# EAGLE design pidcontroller-mega32 (EAGLE 6.5.0)
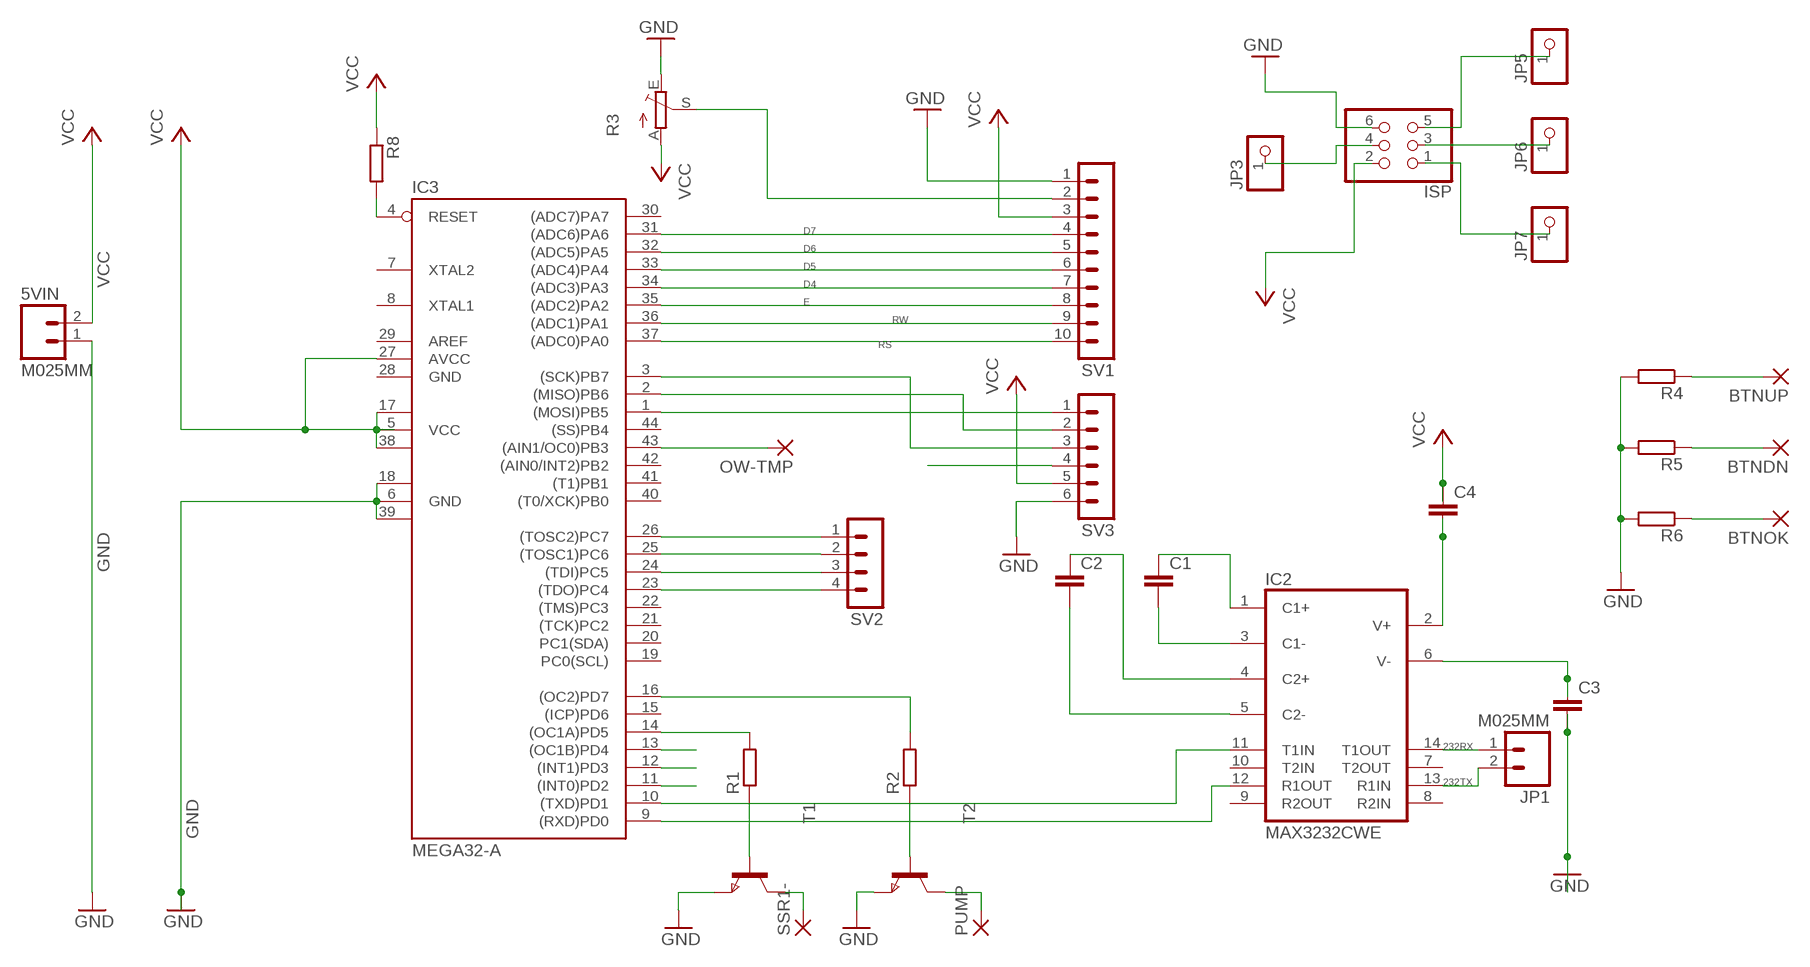
[diagram p0: schematic, sheet 1]

## Parts
5VIN  M025MM  [SCREWTERMINAL-5MM-2]
BTNDN  2,15/1,0  [2,15/1,0]
BTNOK  2,15/1,0  [2,15/1,0]
BTNUP  2,15/1,0  [2,15/1,0]
C1  C-EUC1206  [C1206]
C2  C-EUC1206  [C1206]
C3  C-EUC1206  [C1206]
C4  C-EUC1206  [C1206]
IC2  MAX3232CWE  [SO16L]
IC3  MEGA32-A  [TQFP44]
ISP  PINHD-2X3  [2X03]
JP1  M025MM  [SCREWTERMINAL-5MM-2]
JP3  PINHD-1X1  [1X01]
JP5  PINHD-1X1  [1X01]
JP6  PINHD-1X1  [1X01]
JP7  PINHD-1X1  [1X01]
OW-TMP  2,15/1,0  [2,15/1,0]
PUMP  2,15/1,0  [2,15/1,0]
R1  R-EU_R0603  [R0603]
R2  R-EU_R0603  [R0603]
R3  TRIM_EU-LI10  [LI10]
R4  R-EU_R0603  [R0603]
R5  R-EU_R0603  [R0603]
R6  R-EU_R0603  [R0603]
R8  R-EU_R0603  [R0603]
SSR1-  2,15/1,0  [2,15/1,0]
SV1  MA10-1  [MA10-1]
SV2  MA04-1  [MA04-1]
SV3  MA06-1  [MA06-1]
T1  NPNSOT23  [SOT-23]
T2  NPNSOT23  [SOT-23]

## Nets
232RX: IC2.14(T1OUT) JP1.1
232TX: IC2.13(R1IN) JP1.2
BTNDN: BTNDN.1(P) IC3.12((INT1)PD3) R5.1
BTNOK: BTNOK.1(P) IC3.11((INT0)PD2) R6.1
BTNUP: BTNUP.1(P) IC3.13((OC1B)PD4) R4.1
D4: IC3.34((ADC3)PA3) SV1.7
D5: IC3.33((ADC4)PA4) SV1.6
D6: IC3.32((ADC5)PA5) SV1.5
D7: IC3.31((ADC6)PA6) SV1.4
E: IC3.35((ADC2)PA2) SV1.8
GND: 5VIN.1 C3.2 IC3.6(GND) IC3.18(GND1) IC3.39(GND2) ISP.6 R3.E R4.2 R5.2 R6.2 SV1.1 SV3.6 T1.2(E) T2.2(E)
N$1: IC3.3((SCK)PB7) SV3.3
N$2: R1.1 T1.3(B)
N$3: R2.1 T2.3(B)
N$4: IC3.14((OC1A)PD5) R1.2
N$5: C2.2 IC2.5(C2-)
N$6: C2.1 IC2.4(C2+)
N$7: C1.2 IC2.3(C1-)
N$8: C1.1 IC2.1(C1+)
N$9: C4.2 IC2.2(V+)
N$10: IC3.16((OC2)PD7) R2.2
N$11: C3.1 IC2.6(V-)
N$12: IC2.11(T1IN) IC3.10((TXD)PD1)
N$13: IC2.12(R1OUT) IC3.9((RXD)PD0)
N$14: IC3.1((MOSI)PB5) SV3.1
N$15: IC3.2((MISO)PB6) SV3.2
N$16: IC3.43((AIN1/OC0)PB3) OW-TMP.1(P)
N$17: R3.S SV1.2
N$22: ISP.4 JP3.1
N$23: SSR1-.1(P) T1.1(C)
N$24: PUMP.1(P) T2.1(C)
N$26: ISP.1 JP7.1
N$27: ISP.3 JP6.1
N$28: ISP.5 JP5.1
N$40: IC3.26((TOSC2)PC7) SV2.1
N$41: IC3.25((TOSC1)PC6) SV2.2
N$42: IC3.24((TDI)PC5) SV2.3
N$43: IC3.23((TDO)PC4) SV2.4
RESET: IC3.4(RESET) R8.2 SV3.4
RS: IC3.37((ADC0)PA0) SV1.10
RW: IC3.36((ADC1)PA1) SV1.9
VCC: 5VIN.2 C4.1 IC3.5(VCC) IC3.17(VCC1) IC3.27(AVCC) IC3.38(VCC2) ISP.2 R3.A R8.1 SV1.3 SV3.5
Unconnected: IC2.7(T2OUT) IC2.8(R2IN) IC2.9(R2OUT) IC2.10(T2IN) IC3.7(XTAL2) IC3.8(XTAL1) IC3.15((ICP)PD6) IC3.19(PC0(SCL)) IC3.20(PC1(SDA)) IC3.21((TCK)PC2) IC3.22((TMS)PC3) IC3.29(AREF) IC3.30((ADC7)PA7) IC3.40((T0/XCK)PB0) IC3.41((T1)PB1) IC3.42((AIN0/INT2)PB2) IC3.44((SS)PB4)

## Power pins joined to a net without a drawn wire
GND: IC2.15(GND) IC3.28(GND)
VCC: IC2.16(VCC)

## Library data of the parts
5VIN JP1 = SparkFun-Connectors:M02: Standard 2-pin 0.1" header. Use with - straight break away headers ( PRT-00116) - right angle break away headers (PRT-00553) - swiss pins (PRT-00743) - machine pins (PRT-00117) - female headers (PRT-00115) Molex polarized connector foot print use with: PRT-08233 with associated crimp pins and housings. 2.54_SCREWTERM for use with PRT-10571. 3.5mm Screw Terminal footprints for PRT-08084 5mm Screw Terminal footprints for use with PRT-08433
BTNDN BTNOK BTNUP OW-TMP PUMP SSR1- = wirepad:2,15/1,0: THROUGH-HOLE PAD
C1-C4 = resistor:C-EU: CAPACITOR, European symbol
IC2 = maxim:MAX3232*: True RS-232 Transceivers 3.0V to 5.5V, Low-Power up to 1Mbps, Using Four 0.1µF External Capacitors Source: http://pdfserv.maxim-ic.com/en/ds/MAX3222-MAX3241.pdf; MF: MAXIM; MPN: MAX3232CWE+; OC_FARNELL: 9725504; OC_NEWARK: 68K4630
IC3 = atmel:MEGA32: MICROCONTROLLER 32 Kbytes FLASH 2 Kbytes SRAM 1 Kbytes EEPROM USART 8-channel 10 bit ADC Source: www.atmel.com .. doc2503.pdf; MPN: ATMEGA32-16AU; OC_FARNELL: 9171274; OC_NEWARK: 69K6677
ISP = pinhead:PINHD-2X3: PIN HEADER
JP3 JP5-JP7 = pinhead:PINHD-1X1: PIN HEADER
R1 R2 R4-R6 R8 = resistor:R-EU_: RESISTOR, European symbol
R3 = pot:TRIM_EU-: POTENTIOMETER
SV1 = con-lstb:MA10-1: PIN HEADER; OC_FARNELL: unknown; OC_NEWARK: unknown
SV2 = con-lstb:MA04-1: PIN HEADER; OC_FARNELL: unknown; OC_NEWARK: unknown
SV3 = con-lstb:MA06-1: PIN HEADER; OC_FARNELL: unknown; OC_NEWARK: unknown
T1 T2 = zetex:NPNSOT23: NPN TRANSISTOR; MPN: DSS20201L-7; OC_FARNELL: 1710688; OC_NEWARK: 25R4555

## Net classes
0 default: width 0.381 mm, drill 0.762 mm, clearance 0.381 mm

## Board
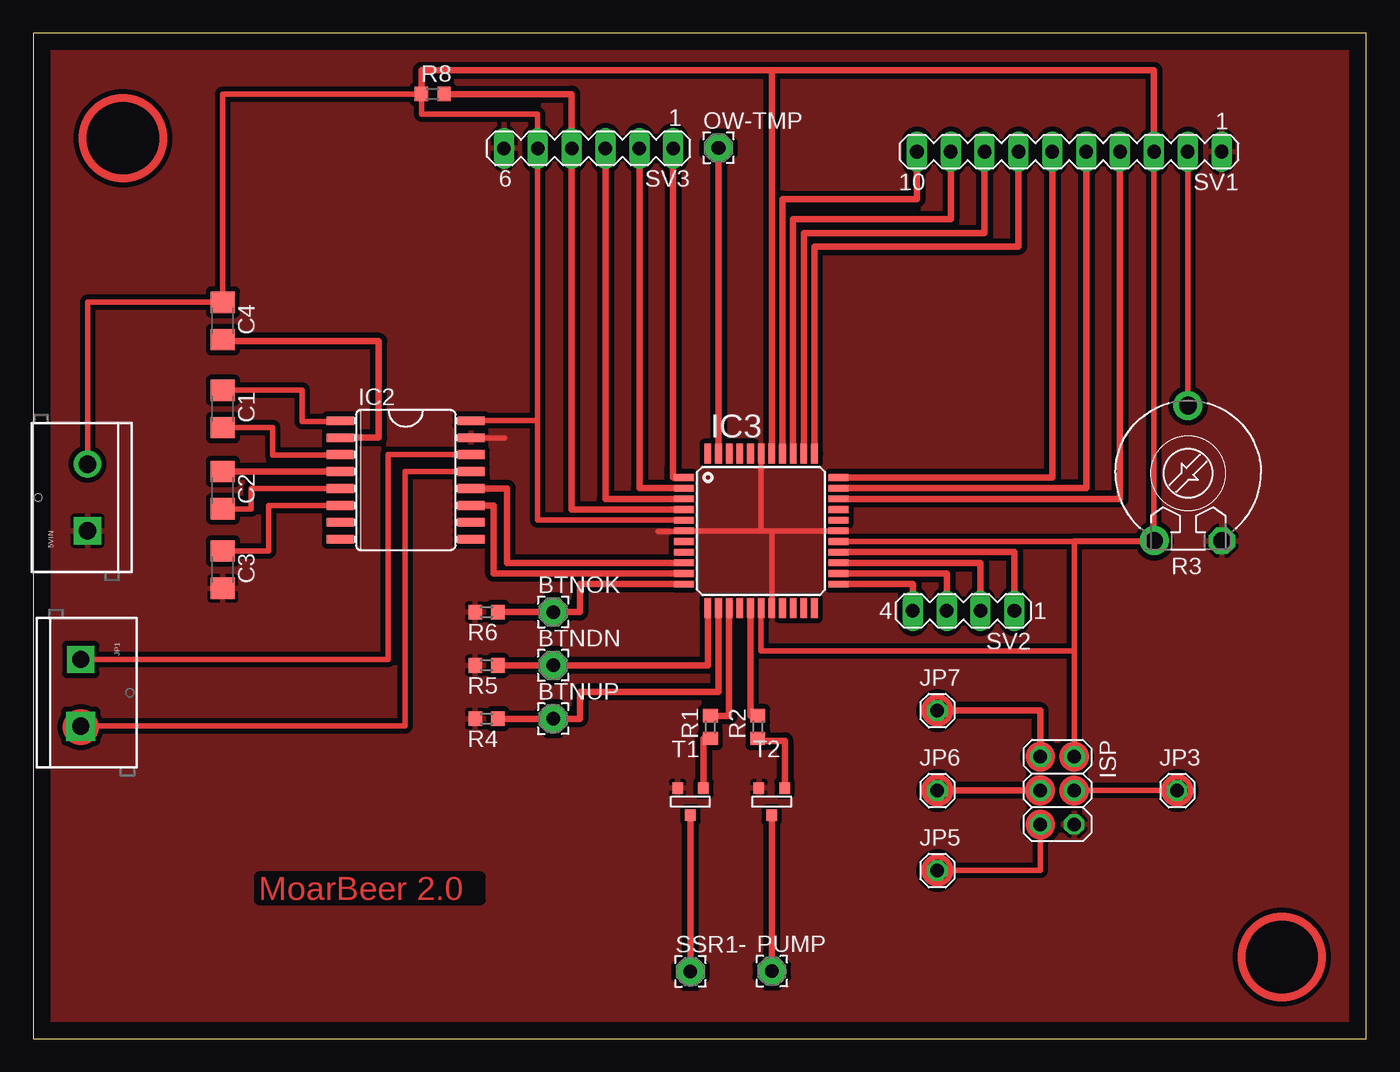
[diagram p1: board, top side]

Size 100 x 75.43 mm. Coordinates in mm from the lower left corner, seen from the top.
Outline: 0,0 100,0 100,75.43 0,75.43 0,0
Copper layers (1*16): Top 0.035mm / dielectric 1.5mm / Bottom 0.035mm
Design rules "default *": minimum track width 8mil, minimum drill 24mil, track to track 7mil, track to pad 7mil, pad to pad 7mil, via to via 7mil, smd to smd 7mil, copper to edge 50mil, drill to drill 10mil, minimum pad ring 10mil, minimum via ring 8mil, stop-mask expansion 4mil, vias tented up to drill 0mil, thermal gap 10mil

### Footprints (pad centres in the part's own frame; a part is rotated, then mirrored left to right if it is on the bottom)
SCREWTERMINAL-5MM-2 = drill 1.3 pad 2.032 square: 1 0,0 | drill 1.3 pad 2.032: 2 5,0
2,15/1,0 = drill 1.016 pad 2.159 octagon: 1 0,0
C1206 = smd 1.6 x 1.8: 1 -1.4,0; 2 1.4,0
SO16L = smd 0.66 x 2.032: 1 -4.445,-4.902; 2 -3.175,-4.902; 3 -1.905,-4.902; 4 -0.635,-4.902; 5 0.635,-4.902; 6 1.905,-4.902; 7 3.175,-4.902; 8 4.445,-4.902; 9 4.445,4.902; 10 3.175,4.902; 11 1.905,4.902; 12 0.635,4.902; 13 -0.635,4.902; 14 -1.905,4.902; 15 -3.175,4.902; 16 -4.445,4.902
TQFP44 = smd 1.5 x 0.5: 1 -5.8,4; 2 -5.8,3.2; 3 -5.8,2.4; 4 -5.8,1.6; 5 -5.8,0.8; 6 -5.8,0; 7 -5.8,-0.8; 8 -5.8,-1.6; 9 -5.8,-2.4; 10 -5.8,-3.2; 11 -5.8,-4; 23 5.8,-4; 24 5.8,-3.2; 25 5.8,-2.4; 26 5.8,-1.6; 27 5.8,-0.8; 28 5.8,0; 29 5.8,0.8; 30 5.8,1.6; 31 5.8,2.4; 32 5.8,3.2; 33 5.8,4 | smd 0.5 x 1.5: 12 -4,-5.8; 13 -3.2,-5.8; 14 -2.4,-5.8; 15 -1.6,-5.8; 16 -0.8,-5.8; 17 0,-5.8; 18 0.8,-5.8; 19 1.6,-5.8; 20 2.4,-5.8; 21 3.2,-5.8; 22 4,-5.8; 34 4,5.8; 35 3.2,5.8; 36 2.4,5.8; 37 1.6,5.8; 38 0.8,5.8; 39 0,5.8; 40 -0.8,5.8; 41 -1.6,5.8; 42 -2.4,5.8; 43 -3.2,5.8; 44 -4,5.8
2X03 = drill 1.016 octagon: 1 -2.54,-1.27; 2 -2.54,1.27; 3 0,-1.27; 4 0,1.27; 5 2.54,-1.27; 6 2.54,1.27
1X01 = drill 1.016 octagon: 1 0,0
R0603 = smd 1 x 1.1: 1 -0.85,0; 2 0.85,0
LI10 = drill 1.321 octagon: A -2.54,-5.08; E 2.54,-5.08; S 0,5.08
MA10-1 = drill 1.016 long: 1 -11.43,0; 2 -8.89,0; 3 -6.35,0; 4 -3.81,0; 5 -1.27,0; 6 1.27,0; 7 3.81,0; 8 6.35,0; 9 8.89,0; 10 11.43,0
MA04-1 = drill 1.016 long: 1 -3.81,0; 2 -1.27,0; 3 1.27,0; 4 3.81,0
MA06-1 = drill 1.016 long: 1 -6.35,0; 2 -3.81,0; 3 -1.27,0; 4 1.27,0; 5 3.81,0; 6 6.35,0
SOT-23 = smd 0.787 x 0.889: 1 0.025,-1.016; 2 -0.94,1.016; 3 0.991,1.016

### Placement (x,y rotation side)
5VIN  4.06,38.1 90 top
BTNDN  39,28 0 top
BTNOK  39,32 0 top
BTNUP  39,24 0 top
C1  14.22,47.24 270 top
C2  14.22,41.15 270 top
C3  14.22,35.18 270 top
C4  14.22,53.85 270 top
IC2  27.94,41.91 270 top
IC3  54.61,38.1 0 top
ISP  76.82,18.61 270 top
JP1  3.56,28.45 270 top
JP3  85.82,18.61 0 top
JP5  67.82,12.61 0 top
JP6  67.82,18.61 0 top
JP7  67.82,24.61 0 top
OW-TMP  51.41,66.83 0 top
PUMP  55.41,5.06 0 top
R1  50.8,23.37 90 top
R2  54.36,23.37 90 top
R3  86.64,42.42 0 top
R4  34,24 180 top
R5  34,28 180 top
R6  34,32 180 top
R8  29.97,70.87 0 top
SSR1-  49.3,5.03 0 top
SV1  77.72,66.55 180 top
SV2  69.8,32.09 180 top
SV3  41.66,66.8 180 top
T1  49.28,17.78 0 top
T2  55.37,17.78 0 top

### Tracks (layer width: path | path; a pad name or v marks a point on that pad's centre or on a via)
232RX
  Top 0.406: JP1.1 26.61,28.45 26.61,43.81 IC2.14
232TX
  Top 0.406: JP1.2 27.9,23.45 27.9,42.55 IC2.13
BTNDN
  Top 0.5: IC3.12 50.61,28 BTNDN.1 R5.1
BTNOK
  Top 0.5: IC3.11 41,34.1 41,32 BTNOK.1 R6.1
BTNUP
  Top 0.5: IC3.13 51.41,26 41,26 41,24 BTNUP.1 R4.1
D4
  Top 0.5: IC3.34 58.61,59.44 73.91,59.44 SV1.7
D5
  Top 0.5: SV1.6 76.45,42.1 IC3.33
D6
  Top 0.5: SV1.5 78.99,41.3 IC3.32
D7
  Top 0.5: SV1.4 81.53,40.5 IC3.31
E
  Top 0.5: IC3.35 57.81,60.45 71.03,60.45 71.12,60.45 71.37,60.45 SV1.8
GND
  Top 0.406: 35.34,45.04 32.88,45.04 arc-90 IC2.15 | 54.61,38.1 IC3.6 48.81,38.05 46.86,38.05 | 54.61,38.1 IC3.39 | IC3.28 55.41,38.1 | 54.61,38.1 55.41,38.1 | 55.41,38.1 IC3.18
  pour Top (isolate 0.35): 0,75 0,0 100,0 100,1 100,75
N$1
  Top 0.5: SV3.3 42.93,40.49 IC3.3
N$2
  Top 0.406: R1.1 50.27,22.52
  Top 0.5: 50.27,22.52 T1.3
N$3
  Top 0.381: 56.39,18.8 T2.3 | 54.36,22.35 R2.1
  Top 0.5: 56.39,18.8 56.39,22.35 54.36,22.35
N$4
  Top 0.5: IC3.14 52.21,24.22 R1.2
N$5
  Top 0.406: IC2.5 16.34,41.27 16.34,39.74 C2.2
N$6
  Top 0.5: IC2.4 C2.1
N$7
  Top 0.406: C1.2 17.95,45.84 17.95,43.79 23.04,43.79 IC2.3
N$8
  Top 0.406: C1.1 20.17,48.64 20.17,46.3 23.04,46.3 IC2.1
N$9
  Top 0.406: 14.22,52.32 C4.2
  Top 0.5: IC2.2 25.91,45.09 25.91,52.32 14.22,52.32
N$10
  Top 0.406: R2.2 53.81,24.22
  Top 0.5: 53.81,24.22 IC3.16
N$11
  Top 0.406: IC2.6 17.65,40.01 17.65,36.58 C3.1
N$12
  Top 0.406: 32.84,40.13 IC2.11
  Top 0.5: IC3.10 34.54,34.9 34.54,40.01 IC2.11
N$13
  Top 0.406: 32.84,41.15 IC2.12
  Top 0.5: IC3.9 35.56,35.7 35.56,41.27 IC2.12
N$14
  Top 0.381: 48.77,42.16 IC3.1
  Top 0.406: 48.01,43 48.01,42.9
  Top 0.5: SV3.1 48.01,43 | IC3.1 48.01,42.1 48.01,42.9
N$15
  Top 0.5: SV3.2 45.47,41.3 IC3.2
N$16
  Top 0.5: OW-TMP.1 IC3.43
N$17
  Top 0.406: SV1.2 86.61,47.52 R3.S
N$18  (via drill 0.6 pad 2.18)
  other vias: 3.56,23.44
N$20  (via drill 0.6 pad 2.18)
  other vias: 86.63,47.49
N$21  (via drill 0.6 pad 1.68)
  other vias: 84.09,37.4
N$22
  Top 0.406: JP3.1 ISP.4
N$23
  Top 0.5: SSR1-.1 T1.1 | T1.1
N$24
  Top 0.381: 55.37,16.76 T2.1
  Top 0.5: PUMP.1 T2.1
N$25  (via drill 0.6 pad 2.18)
  other vias: 84.1,37.36
N$26
  Top 0.5: ISP.1 75.55,24.61 JP7.1
N$27
  Top 0.5: ISP.3 JP6.1
N$28
  Top 0.406: JP5.1 75.55,12.61 ISP.5
N$33  (via drill 0.6 pad 1.27)
  other vias: 4.06,43.1
N$36
  Top 0.61: 75.47,18.55 75.47,18.61
N$38
  pour Top: 26.49,73.59 25.6,73.59 25.6,24.18 91.22,23.21 91.78,23.21 91.78,73.59
N$40
  Top 0.5: IC3.26 73.61,36.5 SV2.1
N$41
  Top 0.5: IC3.25 71.07,35.7 SV2.2
N$42
  Top 0.5: IC3.24 68.53,34.9 SV2.3
N$43
  Top 0.5: IC3.23 65.99,34.1 SV2.4
RESET
  Top 0.5: IC3.4 40.39,39.7 SV3.4 40.39,70.87 R8.2
RS
  Top 0.5: IC3.37 56.21,62.99 66.29,62.99 SV1.10
RW
  Top 0.5: IC3.36 57.01,61.47 68.43,61.47 68.58,61.47 68.83,61.47 SV1.9
VCC
  Top 0.406: IC2.16 37.85,46.35 | 37.85,46.35 SV3.5 37.84,69.36 29.12,69.36 R8.1 14.22,70.87 C4.1 4.06,55.25 5VIN.2 | ISP.2 78.09,29.1 | 78.09,29.1 78.09,37.34 R3.A 84.11,37.3 84.06,37.3 | 84.06,37.3 R3.A | IC3.27 84.06,37.3 | 84.06,37.3 84.07,37.3 SV1.3 | IC3.17 54.61,29.1 78.09,29.1 | 37.85,46.35 37.85,38.9 IC3.5
  Top 0.5: IC3.38 55.41,72.64 | 55.41,72.64 84.07,72.64 SV1.3 | R8.1 29.12,72.64 55.41,72.64
(copper drawn outside any net)
  shapes: Top circle x14

### Text on the board
Top: MoarBeer 2.0